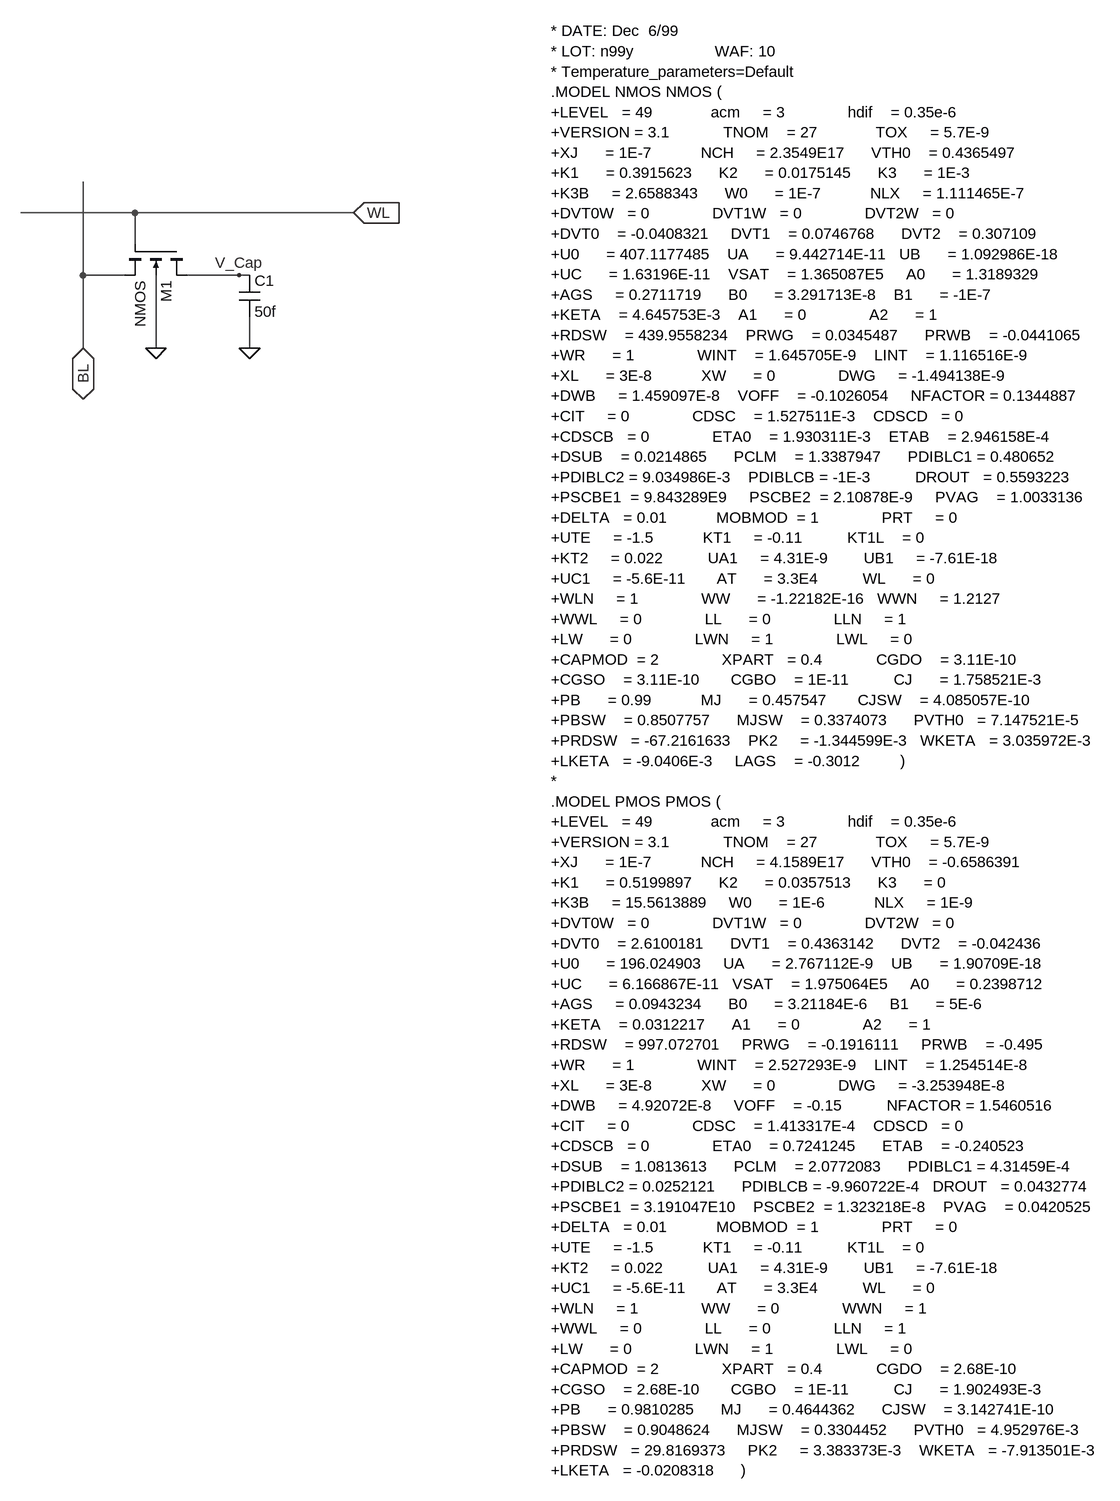
[diagram p0: schematic DRAMCell.asc]
DRAMCell.asc, the LTspice schematic file:
Version 4
SHEET 1 880 1444
WIRE -1680 -992 -1856 -992
WIRE -1344 -992 -1680 -992
WIRE -1680 -944 -1680 -992
WIRE -1760 -896 -1760 -1040
WIRE -1696 -896 -1760 -896
WIRE -1520 -896 -1600 -896
WIRE -1504 -896 -1520 -896
WIRE -1760 -784 -1760 -896
WIRE -1648 -784 -1648 -896
WIRE -1504 -784 -1504 -832
FLAG -1504 -784 0
FLAG -1344 -992 WL
IOPIN -1344 -992 In
FLAG -1648 -784 0
FLAG -1520 -896 V_Cap
FLAG -1760 -784 BL
IOPIN -1760 -784 BiDir
SYMBOL nmos4 -1600 -944 R90
SYMATTR InstName M1
SYMATTR Value2 l=0.25u w=0.375u
SYMBOL cap -1520 -896 R0
SYMATTR InstName C1
SYMATTR Value 50f
TEXT -1040 -1272 Left 2 !* DATE: Dec  6/99\n* LOT: n99y                  WAF: 10\n* Temperature_parameters=Default\n.MODEL NMOS NMOS (\n+LEVEL   = 49             acm     = 3              hdif    = 0.35e-6\n+VERSION = 3.1            TNOM    = 27             TOX     = 5.7E-9\n+XJ      = 1E-7           NCH     = 2.3549E17      VTH0    = 0.4365497\n+K1      = 0.3915623      K2      = 0.0175145      K3      = 1E-3\n+K3B     = 2.6588343      W0      = 1E-7           NLX     = 1.111465E-7\n+DVT0W   = 0              DVT1W   = 0              DVT2W   = 0\n+DVT0    = -0.0408321     DVT1    = 0.0746768      DVT2    = 0.307109\n+U0      = 407.1177485    UA      = 9.442714E-11   UB      = 1.092986E-18\n+UC      = 1.63196E-11    VSAT    = 1.365087E5     A0      = 1.3189329\n+AGS     = 0.2711719      B0      = 3.291713E-8    B1      = -1E-7\n+KETA    = 4.645753E-3    A1      = 0              A2      = 1\n+RDSW    = 439.9558234    PRWG    = 0.0345487      PRWB    = -0.0441065\n+WR      = 1              WINT    = 1.645705E-9    LINT    = 1.116516E-9\n+XL      = 3E-8           XW      = 0              DWG     = -1.494138E-9\n+DWB     = 1.459097E-8    VOFF    = -0.1026054     NFACTOR = 0.1344887\n+CIT     = 0              CDSC    = 1.527511E-3    CDSCD   = 0\n+CDSCB   = 0              ETA0    = 1.930311E-3    ETAB    = 2.946158E-4\n+DSUB    = 0.0214865      PCLM    = 1.3387947      PDIBLC1 = 0.480652\n+PDIBLC2 = 9.034986E-3    PDIBLCB = -1E-3          DROUT   = 0.5593223\n+PSCBE1  = 9.843289E9     PSCBE2  = 2.10878E-9     PVAG    = 1.0033136\n+DELTA   = 0.01           MOBMOD  = 1              PRT     = 0\n+UTE     = -1.5           KT1     = -0.11          KT1L    = 0\n+KT2     = 0.022          UA1     = 4.31E-9        UB1     = -7.61E-18\n+UC1     = -5.6E-11       AT      = 3.3E4          WL      = 0\n+WLN     = 1              WW      = -1.22182E-16   WWN     = 1.2127\n+WWL     = 0              LL      = 0              LLN     = 1\n+LW      = 0              LWN     = 1              LWL     = 0\n+CAPMOD  = 2              XPART   = 0.4            CGDO    = 3.11E-10\n+CGSO    = 3.11E-10       CGBO    = 1E-11          CJ      = 1.758521E-3\n+PB      = 0.99           MJ      = 0.457547       CJSW    = 4.085057E-10\n+PBSW    = 0.8507757      MJSW    = 0.3374073      PVTH0   = 7.147521E-5\n+PRDSW   = -67.2161633    PK2     = -1.344599E-3   WKETA   = 3.035972E-3\n+LKETA   = -9.0406E-3     LAGS    = -0.3012         )\n*\n.MODEL PMOS PMOS (\n+LEVEL   = 49             acm     = 3              hdif    = 0.35e-6\n+VERSION = 3.1            TNOM    = 27             TOX     = 5.7E-9\n+XJ      = 1E-7           NCH     = 4.1589E17      VTH0    = -0.6586391\n+K1      = 0.5199897      K2      = 0.0357513      K3      = 0\n+K3B     = 15.5613889     W0      = 1E-6           NLX     = 1E-9\n+DVT0W   = 0              DVT1W   = 0              DVT2W   = 0\n+DVT0    = 2.6100181      DVT1    = 0.4363142      DVT2    = -0.042436\n+U0      = 196.024903     UA      = 2.767112E-9    UB      = 1.90709E-18\n+UC      = 6.166867E-11   VSAT    = 1.975064E5     A0      = 0.2398712\n+AGS     = 0.0943234      B0      = 3.21184E-6     B1      = 5E-6\n+KETA    = 0.0312217      A1      = 0              A2      = 1\n+RDSW    = 997.072701     PRWG    = -0.1916111     PRWB    = -0.495\n+WR      = 1              WINT    = 2.527293E-9    LINT    = 1.254514E-8\n+XL      = 3E-8           XW      = 0              DWG     = -3.253948E-8\n+DWB     = 4.92072E-8     VOFF    = -0.15          NFACTOR = 1.5460516\n+CIT     = 0              CDSC    = 1.413317E-4    CDSCD   = 0\n+CDSCB   = 0              ETA0    = 0.7241245      ETAB    = -0.240523\n+DSUB    = 1.0813613      PCLM    = 2.0772083      PDIBLC1 = 4.31459E-4\n+PDIBLC2 = 0.0252121      PDIBLCB = -9.960722E-4   DROUT   = 0.0432774\n+PSCBE1  = 3.191047E10    PSCBE2  = 1.323218E-8    PVAG    = 0.0420525\n+DELTA   = 0.01           MOBMOD  = 1              PRT     = 0\n+UTE     = -1.5           KT1     = -0.11          KT1L    = 0\n+KT2     = 0.022          UA1     = 4.31E-9        UB1     = -7.61E-18\n+UC1     = -5.6E-11       AT      = 3.3E4          WL      = 0\n+WLN     = 1              WW      = 0              WWN     = 1\n+WWL     = 0              LL      = 0              LLN     = 1\n+LW      = 0              LWN     = 1              LWL     = 0\n+CAPMOD  = 2              XPART   = 0.4            CGDO    = 2.68E-10\n+CGSO    = 2.68E-10       CGBO    = 1E-11          CJ      = 1.902493E-3\n+PB      = 0.9810285      MJ      = 0.4644362      CJSW    = 3.142741E-10\n+PBSW    = 0.9048624      MJSW    = 0.3304452      PVTH0   = 4.952976E-3\n+PRDSW   = 29.8169373     PK2     = 3.383373E-3    WKETA   = -7.913501E-3\n+LKETA   = -0.0208318      )

The netlist it stands for:
* DRAMCell.asc
M1 V_Cap WL BL 0 NMOS l=0.25u w=0.375u
C1 V_Cap 0 50f
.model NMOS NMOS
.model PMOS PMOS
.lib standard.mos
* DATE: Dec  6/99
* LOT: n99y                  WAF: 10
* Temperature_parameters=Default
.MODEL NMOS NMOS (
+LEVEL   = 49             acm     = 3              hdif    = 0.35e-6
+VERSION = 3.1            TNOM    = 27             TOX     = 5.7E-9
+XJ      = 1E-7           NCH     = 2.3549E17      VTH0    = 0.4365497
+K1      = 0.3915623      K2      = 0.0175145      K3      = 1E-3
+K3B     = 2.6588343      W0      = 1E-7           NLX     = 1.111465E-7
+DVT0W   = 0              DVT1W   = 0              DVT2W   = 0
+DVT0    = -0.0408321     DVT1    = 0.0746768      DVT2    = 0.307109
+U0      = 407.1177485    UA      = 9.442714E-11   UB      = 1.092986E-18
+UC      = 1.63196E-11    VSAT    = 1.365087E5     A0      = 1.3189329
+AGS     = 0.2711719      B0      = 3.291713E-8    B1      = -1E-7
+KETA    = 4.645753E-3    A1      = 0              A2      = 1
+RDSW    = 439.9558234    PRWG    = 0.0345487      PRWB    = -0.0441065
+WR      = 1              WINT    = 1.645705E-9    LINT    = 1.116516E-9
+XL      = 3E-8           XW      = 0              DWG     = -1.494138E-9
+DWB     = 1.459097E-8    VOFF    = -0.1026054     NFACTOR = 0.1344887
+CIT     = 0              CDSC    = 1.527511E-3    CDSCD   = 0
+CDSCB   = 0              ETA0    = 1.930311E-3    ETAB    = 2.946158E-4
+DSUB    = 0.0214865      PCLM    = 1.3387947      PDIBLC1 = 0.480652
+PDIBLC2 = 9.034986E-3    PDIBLCB = -1E-3          DROUT   = 0.5593223
+PSCBE1  = 9.843289E9     PSCBE2  = 2.10878E-9     PVAG    = 1.0033136
+DELTA   = 0.01           MOBMOD  = 1              PRT     = 0
+UTE     = -1.5           KT1     = -0.11          KT1L    = 0
+KT2     = 0.022          UA1     = 4.31E-9        UB1     = -7.61E-18
+UC1     = -5.6E-11       AT      = 3.3E4          WL      = 0
+WLN     = 1              WW      = -1.22182E-16   WWN     = 1.2127
+WWL     = 0              LL      = 0              LLN     = 1
+LW      = 0              LWN     = 1              LWL     = 0
+CAPMOD  = 2              XPART   = 0.4            CGDO    = 3.11E-10
+CGSO    = 3.11E-10       CGBO    = 1E-11          CJ      = 1.758521E-3
+PB      = 0.99           MJ      = 0.457547       CJSW    = 4.085057E-10
+PBSW    = 0.8507757      MJSW    = 0.3374073      PVTH0   = 7.147521E-5
+PRDSW   = -67.2161633    PK2     = -1.344599E-3   WKETA   = 3.035972E-3
+LKETA   = -9.0406E-3     LAGS    = -0.3012         )
*
.MODEL PMOS PMOS (
+LEVEL   = 49             acm     = 3              hdif    = 0.35e-6
+VERSION = 3.1            TNOM    = 27             TOX     = 5.7E-9
+XJ      = 1E-7           NCH     = 4.1589E17      VTH0    = -0.6586391
+K1      = 0.5199897      K2      = 0.0357513      K3      = 0
+K3B     = 15.5613889     W0      = 1E-6           NLX     = 1E-9
+DVT0W   = 0              DVT1W   = 0              DVT2W   = 0
+DVT0    = 2.6100181      DVT1    = 0.4363142      DVT2    = -0.042436
+U0      = 196.024903     UA      = 2.767112E-9    UB      = 1.90709E-18
+UC      = 6.166867E-11   VSAT    = 1.975064E5     A0      = 0.2398712
+AGS     = 0.0943234      B0      = 3.21184E-6     B1      = 5E-6
+KETA    = 0.0312217      A1      = 0              A2      = 1
+RDSW    = 997.072701     PRWG    = -0.1916111     PRWB    = -0.495
+WR      = 1              WINT    = 2.527293E-9    LINT    = 1.254514E-8
+XL      = 3E-8           XW      = 0              DWG     = -3.253948E-8
+DWB     = 4.92072E-8     VOFF    = -0.15          NFACTOR = 1.5460516
+CIT     = 0              CDSC    = 1.413317E-4    CDSCD   = 0
+CDSCB   = 0              ETA0    = 0.7241245      ETAB    = -0.240523
+DSUB    = 1.0813613      PCLM    = 2.0772083      PDIBLC1 = 4.31459E-4
+PDIBLC2 = 0.0252121      PDIBLCB = -9.960722E-4   DROUT   = 0.0432774
+PSCBE1  = 3.191047E10    PSCBE2  = 1.323218E-8    PVAG    = 0.0420525
+DELTA   = 0.01           MOBMOD  = 1              PRT     = 0
+UTE     = -1.5           KT1     = -0.11          KT1L    = 0
+KT2     = 0.022          UA1     = 4.31E-9        UB1     = -7.61E-18
+UC1     = -5.6E-11       AT      = 3.3E4          WL      = 0
+WLN     = 1              WW      = 0              WWN     = 1
+WWL     = 0              LL      = 0              LLN     = 1
+LW      = 0              LWN     = 1              LWL     = 0
+CAPMOD  = 2              XPART   = 0.4            CGDO    = 2.68E-10
+CGSO    = 2.68E-10       CGBO    = 1E-11          CJ      = 1.902493E-3
+PB      = 0.9810285      MJ      = 0.4644362      CJSW    = 3.142741E-10
+PBSW    = 0.9048624      MJSW    = 0.3304452      PVTH0   = 4.952976E-3
+PRDSW   = 29.8169373     PK2     = 3.383373E-3    WKETA   = -7.913501E-3
+LKETA   = -0.0208318      )
.backanno
.end